# EAGLE schematic PSU_interface (EAGLE 7.1.0)
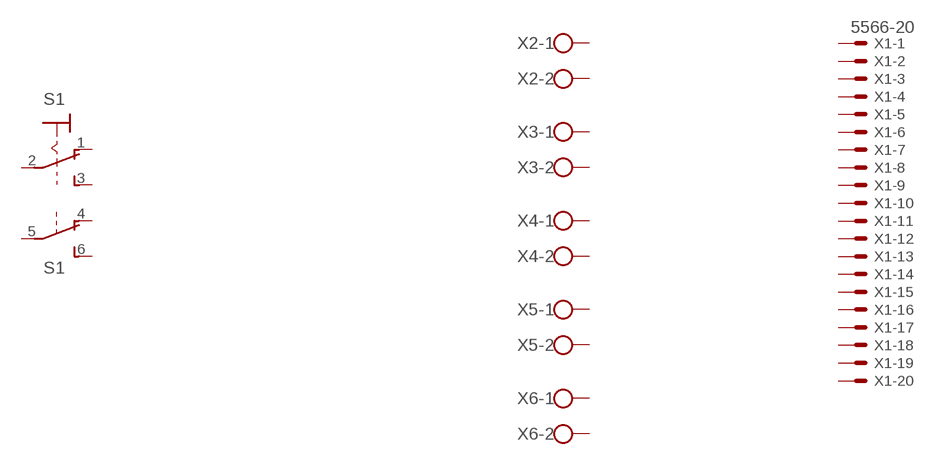
[diagram p0: schematic, sheet 1]

## Parts
S1  320-938  [320-938]
X1  5566-20  [5566-20]
X2  W237-102  [W237-102]
X3  W237-102  [W237-102]
X4  W237-102  [W237-102]
X5  W237-102  [W237-102]
X6  W237-102  [W237-102]
Unconnected: S1.1(1:O) S1.2(1:P) S1.3(1:S) S1.4(B:O) S1.5(B:P) S1.6(B:S) X1.1 X1.2 X1.3 X1.4 X1.5 X1.6 X1.7 X1.8 X1.9 X1.10 X1.11 X1.12 X1.13 X1.14 X1.15 X1.16 X1.17 X1.18 X1.19 X1.20 X2.1 X2.2 X3.1 X3.2 X4.1 X4.2 X5.1 X5.2 X6.1 X6.2

## Library data of the parts
S1 = switch:320-938: TOGGLE SWITCH distributor RS Components
X1 = con-molex:5566-20: Mini FIT connector 20 pol ATX PC-Motherboard Power connector Source: http://www.molex.com; OC_FARNELL: unknown; OC_NEWARK: unknown
X2-X6 = con-wago-500:W237-102: WAGO SCREW CLAMP; MPN: 237-102; OC_FARNELL: unknown; OC_NEWARK: 70K9898